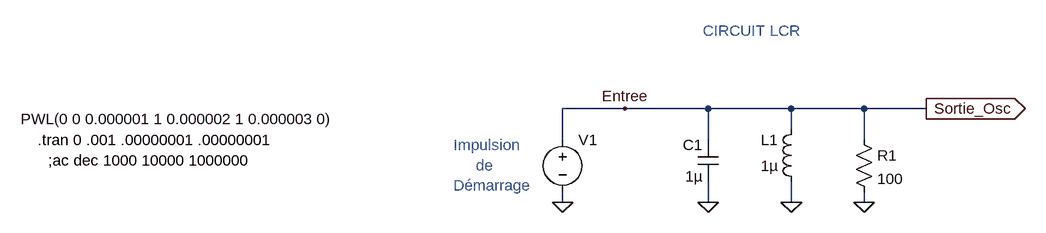
[diagram p0: schematic Circuit_LC.asc]
Circuit_LC.asc, the LTspice schematic file:
Version 4
SHEET 1 880 680
WIRE -16 192 -112 192
WIRE 112 192 -16 192
WIRE 240 192 112 192
WIRE 352 192 240 192
WIRE 448 192 352 192
WIRE 240 224 240 192
WIRE -112 240 -112 192
WIRE 112 240 112 192
WIRE 352 240 352 192
WIRE -112 336 -112 320
WIRE 112 336 112 304
WIRE 240 336 240 304
WIRE 352 336 352 320
FLAG 448 192 Sortie_Osc
IOPIN 448 192 Out
FLAG -112 336 0
FLAG -16 192 Entree
FLAG 240 336 0
FLAG 112 336 0
FLAG 352 336 0
SYMBOL voltage -112 224 R0
WINDOW 3 -834 -16 Left 2
SYMATTR Value2 AC 1
SYMATTR SpiceLine Rser=100
SYMATTR Value PWL(0 0 0.000001 1 0.000002 1 0.000003 0)
SYMATTR InstName V1
SYMBOL ind 256 320 R180
WINDOW 0 36 80 Left 2
WINDOW 3 36 40 Left 2
SYMATTR InstName L1
SYMATTR Value 1µ
SYMBOL cap 128 304 R180
WINDOW 0 24 56 Left 2
WINDOW 3 24 8 Left 2
SYMATTR InstName C1
SYMATTR Value 1µ
SYMBOL res 336 224 R0
SYMATTR InstName R1
SYMATTR Value 100
TEXT -920 240 Left 2 !.tran 0 .001 .00000001 .00000001
TEXT -904 272 Left 2 !;ac dec 1000 10000 1000000
TEXT -280 248 Left 2 ;Impulsion \n     de \nDémarrage
TEXT 104 72 Left 2 ;CIRCUIT LCR

The netlist it stands for:
* Circuit_LC.asc
V1 Entree 0 PWL(0 0 0.000001 1 0.000002 1 0.000003 0) AC 1 Rser=100
L1 0 Entree 1µ
C1 0 Entree 1µ
R1 Entree 0 100
.tran 0 .001 .00000001 .00000001
;ac dec 1000 10000 1000000
* Impulsion
*      de
* Démarrage
* CIRCUIT LCR
.backanno
.end